# EAGLE design Röle Modülü Tek (EAGLE 9.6.2)
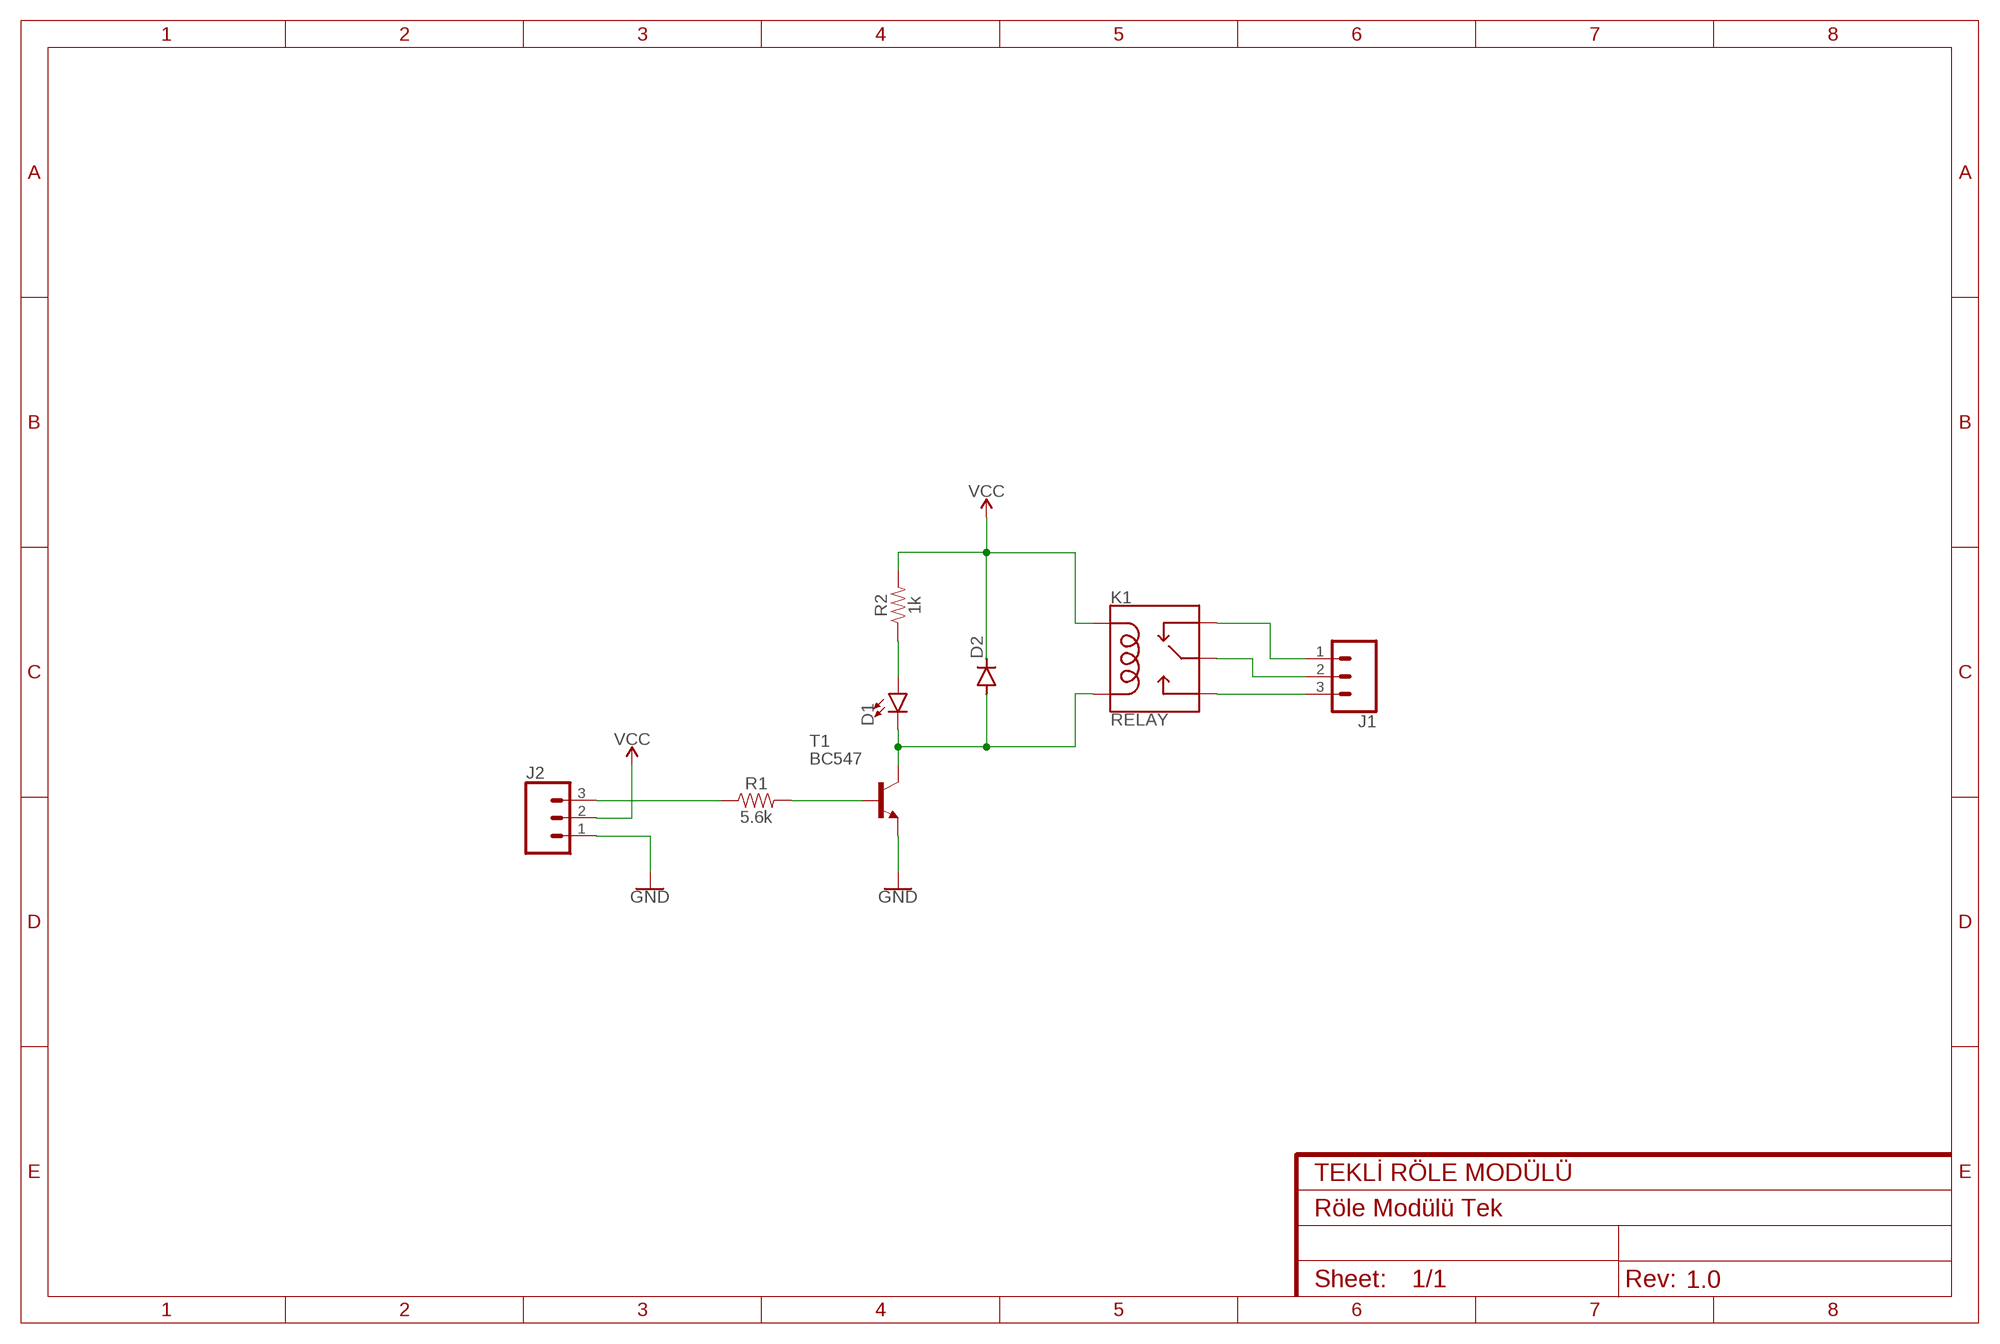
[diagram p0: schematic, sheet 1]
FRAME1 (FRAME-A4L): CNAME: TEKLİ RÖLE MODÜLÜ; CREVISION: 1.0

## Parts
D1  LED3MM  [LED_3MM]
D2  DIODE-DO07  [DO07]
J1  CONN_03  [1X03]
J2  CONN_03  [1X03]
K1  RELAY  RELAY-SPDT-JZC-11F  [RELAY-JZC]
R1  5.6k  1KOHM-HORIZ-1/4W-1%  [AXIAL-0.3]
R2  1k  1KOHM-HORIZ-1/4W-1%  [AXIAL-0.3]
T1  BC547  [TO92]

## Nets
GND: J2.1 T1.1(E)
N$1: R1.P$2 T1.2(B)
N$2: D1.K(C) D2.A K1.1(COIL2) T1.3(C)
N$3: D1.A R2.P$1
N$5: J2.3 R1.P$1
N$7: J1.1 K1.2(NC)
N$8: J1.2 K1.4(MAIN)
N$9: J1.3 K1.3(NO)
VCC: D2.C J2.2 K1.5(COIL1) R2.P$2

## Library data of the parts
D1 = SparkFun-LED1:LED: LED (Generic) Standard schematic elements and footprints for 5mm, 3mm, 1206, and 0603 sized LEDs. Generic LEDs with no color specified.; PROD_ID: DIO-08794
D2 = diode:DIODE-: DIODE
J1 J2 = SparkFun-Connectors:CONN_03: Multi connection point. Often used as Generic Header-pin footprint for 0.1 inch spaced/style header connections On any of the 0.1 inch spaced packages, you can populate with these: Break Away Headers - Straight <https://www.sparkfun.com/products/116> (PRT-00116) Break Away Male Headers - Right Angle <https://www.sparkfun.com/products/553> (PRT-00553) Female Headers <https://www.sparkfun.com/products/115> (PRT-00115) Break Away Headers - Machine Pin <https://www.sparkfun.com/products/117> (PRT-00117) Break Away Female Headers - Swiss Machine Pin <https://www.sparkfun.com/products/743> (PRT-00743) Stackable Header - 3 Pin (Female, 0.1") <https://www.sparkfun.com/products/13875> (PRT-13875) For SCREWTERMINALS and SPRING TERMINALS visit here: Screw Terimnals on SparkFun.com <https://www.sparkfun.com/search/results?term=Screw+Terminals> (5mm/3.5mm/2.54mm spacing) This device is also useful as a general connection point to wire up your design to another part of your project. Our various solder wires solder well into these plated through hole pads. Hook-Up Wire - Assortment (Stranded, 22 AWG) <https://www.sparkfun.com/products/11375> (PRT-11375) Hook-Up Wire - Assortment (Solid Core, 22 AWG) <https://www.sparkfun.com/products/11367> (PRT-11367) View the entire wire category on our website here <https://www.sparkfun.com/categories/141> Special notes: Molex polarized connector foot print use with SKU : PRT-08232 with associated crimp pins and housings.
K1 = SparkFun-Electromechanical:RELAY-SPDT: SPDT Electromechanical Relay Single-pole, double-throw sealed relays. When current is applied to the coil, it throws a simple changeover switch, terminating the connection from the NC contact to ground and closing the NO contact. Use them to switch high voltage/high current devices. SparkFun Products JQX-15F: Relay SPDT Sealed - 20A <https://www.sparkfun.com/products/10924> (COM-10924) JZC-11F: Relay SPDT Sealed <https://www.sparkfun.com/products/100> (COM-00100); PROD_ID: COMP-09533; SF_SKU: COM-00100
R1 = SparkFun-Resistors1:1KOHM: 1kΩ resistor A resistor is a passive two-terminal electrical component that implements electrical resistance as a circuit element. Resistors act to reduce current flow, and, at the same time, act to lower voltage levels within circuits. - Wikipedia; PROD_ID: RES-12182; VALUE: 1k
R2 = SparkFun-Resistors1:1KOHM: 1kΩ resistor A resistor is a passive two-terminal electrical component that implements electrical resistance as a circuit element. Resistors act to reduce current flow, and, at the same time, act to lower voltage levels within circuits. - Wikipedia; PROD_ID: RES-12182
T1 = transistor:BC547: NPN TRANSISTOR

## Board
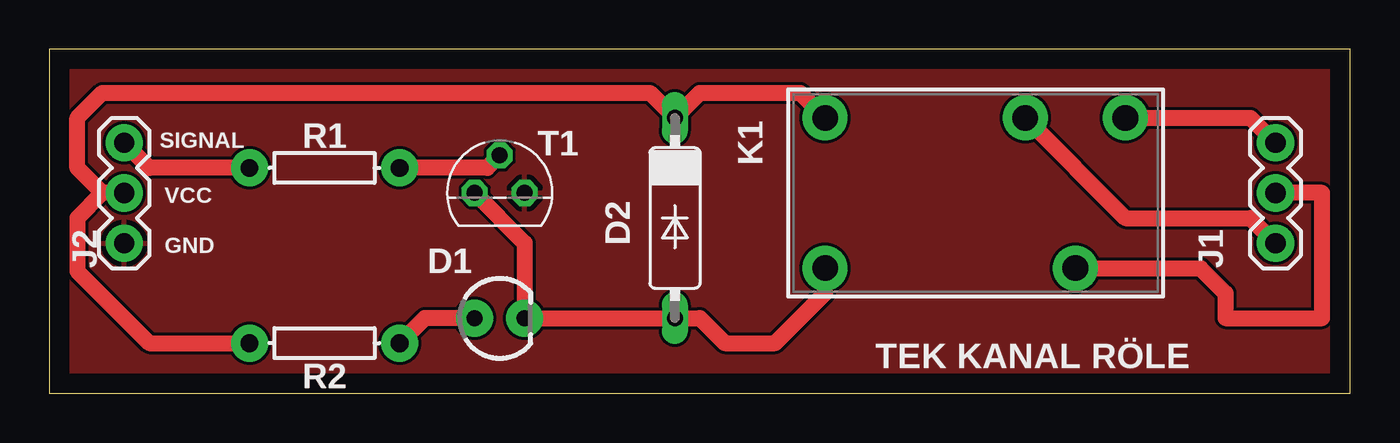
[diagram p1: board, top side]
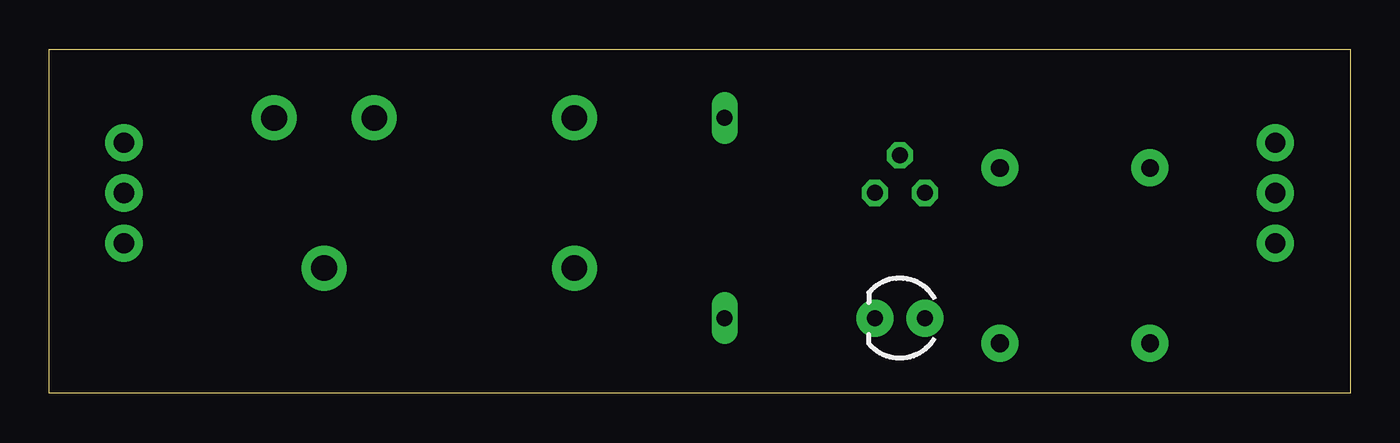
[diagram p2: board, bottom side, seen from below]

Size 66.02 x 17.45 mm. Coordinates in mm from the lower left corner, seen from the top.
Outline: 0,0 66.02,0 66.02,17.45 0,17.45 0,0
Copper layers (1*16): Top 0.035mm / dielectric 1.5mm / Bottom 0.035mm
Design rules "default": minimum track width 6mil, minimum drill 0.35mm, track to track 6mil, track to pad 6mil, pad to pad 6mil, via to via 6mil, smd to smd 6mil, copper to edge 40mil, drill to drill 6mil, minimum pad ring 10mil, minimum via ring 8mil, stop-mask expansion 4mil, vias tented up to drill 0mil, thermal gap 10mil

### Footprints (pad centres in the part's own frame; a part is rotated, then mirrored left to right if it is on the bottom)
LED_3MM = drill 0.813 pad 1.88: A -1.27,0; K 1.27,0
DO07 = drill 0.813 long: A 5.08,0; C -5.08,0
1X03 = drill 1.016 pad 1.88: 1 0,0; 2 2.54,0; 3 5.08,0
RELAY-JZC = drill 1.3 pad 2.286: 1 3.81,-8.89; 2 -3.81,1.27; 3 -3.81,6.35; 4 3.81,3.81; 5 -3.81,-8.89
AXIAL-0.3 = drill 0.9 pad 1.88: P$1 -3.81,0; P$2 3.81,0
TO92 = drill 0.813 octagon: 1 1.27,0; 2 0,1.905; 3 -1.27,0

### Placement (x,y rotation side)
D1  22.86,3.81 0 top
D2  31.75,8.89 270 top
J1  62.23,7.62 90 top
J2  3.81,7.62 90 top
K1  48.26,10.16 270 top
R1  13.97,11.43 0 top
R2  13.97,2.54 180 top
T1  22.86,10.16 0 top

### Tracks (layer width: path | path; a pad name or v marks a point on that pad's centre or on a via)
GND
  pour Top: 0,19.05 67.31,19.05 67.31,-2.54 -1.27,-2.54 -1.27,19.05
N$1
  Top 0.813: T1.2 22.23,11.43 R1.P$2
N$2
  Top 0.813: T1.3 24.13,7.62 D1.K D2.A 33.02,3.81 34.29,2.54 36.83,2.54 39.37,5.08 K1.1
N$3
  Top 0.813: D1.A 19.05,3.81 R2.P$1
N$5
  Top 0.813: R1.P$1 5.08,11.43 J2.3
N$7
  Top 0.813: J1.1 60.96,8.89 54.61,8.89 K1.2
N$8
  Top 0.813: K1.4 58.42,6.35 59.69,5.08 59.69,3.81 64.6,3.81 64.6,10.16 J1.2
N$9
  Top 0.813: J1.3 60.96,13.97 K1.3
VCC
  Top 0.813: 2.69,10.16 1.42,8.89 1.42,6.2 5.08,2.54 R2.P$2 | J2.2 2.69,10.16 | 2.69,10.16 1.42,11.43 1.42,13.97 2.69,15.24 30.48,15.24 D2.C 33.02,15.24 38.1,15.24 K1.5

### Text on the board
tPlace: SIGNAL | VCC | GND
tNames: TEK KANAL RÖLE